# Altium schematic sheet PCIe_USB30.SchDoc
size A4; SheetNumber: 9; SheetTotal: 12
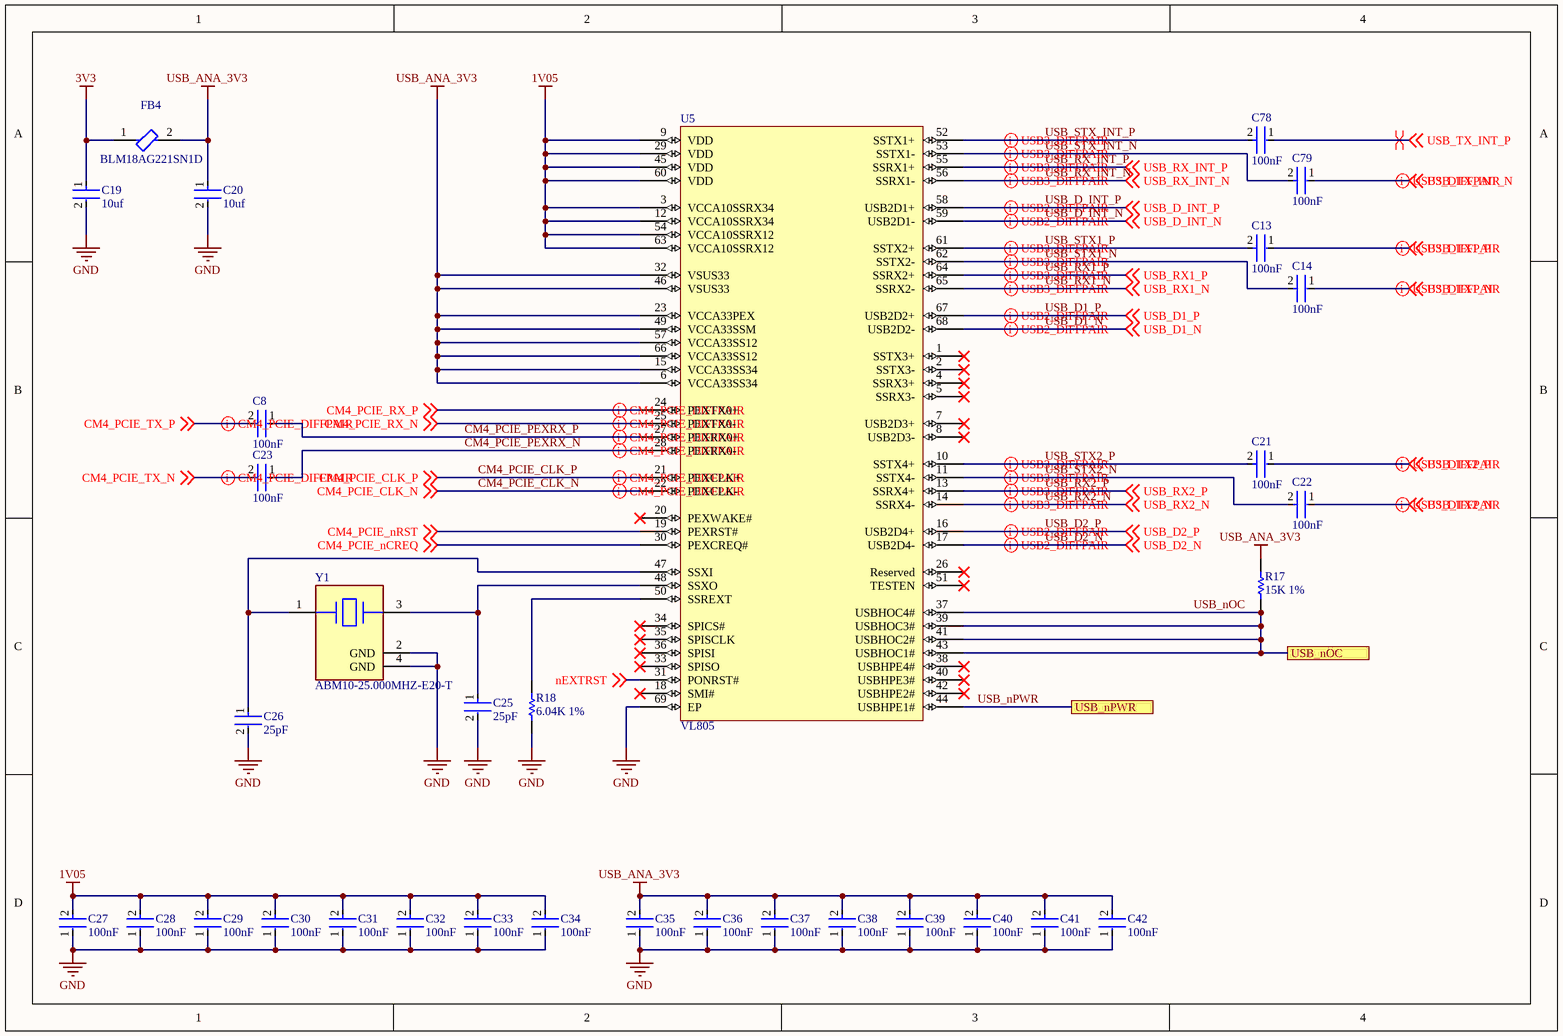
[diagram p0: PCIe_USB30.SchDoc]

## Parts
C8  100nF  [FP-GRM15-MFG]
C13  100nF  [FP-GRM15-MFG]
C14  100nF  [FP-GRM15-MFG]
C19  10uf  [FP-GRM188-0_2-IPC_C]
C20  10uf  [FP-GRM188-0_2-IPC_C]
C21  100nF  [FP-GRM15-MFG]
C22  100nF  [FP-GRM15-MFG]
C23  100nF  [FP-GRM15-MFG]
C25  25pF  [FP-C0402-BB-MFG]
C26  25pF  [FP-C0402-BB-MFG]
C27  100nF  [FP-GRM15-MFG]
C28  100nF  [FP-GRM15-MFG]
C29  100nF  [FP-GRM15-MFG]
C30  100nF  [FP-GRM15-MFG]
C31  100nF  [FP-GRM15-MFG]
C32  100nF  [FP-GRM15-MFG]
C33  100nF  [FP-GRM15-MFG]
C34  100nF  [FP-GRM15-MFG]
C35  100nF  [FP-GRM15-MFG]
C36  100nF  [FP-GRM15-MFG]
C37  100nF  [FP-GRM15-MFG]
C38  100nF  [FP-GRM15-MFG]
C39  100nF  [FP-GRM15-MFG]
C40  100nF  [FP-GRM15-MFG]
C41  100nF  [FP-GRM15-MFG]
C42  100nF  [FP-GRM15-MFG]
C78  100nF  [FP-GRM15-MFG]
C79  100nF  [FP-GRM15-MFG]
FB4  BLM18AG221SN1D  [FP-BLM18-0_15-t0_8-IPC_A]
R17  15K 1%  [RESC1005X40X25ML05T10]
R18  6.04K 1%  [RESC1005X40X25LL05T10]
U5  VL805  [VL805]
Y1  ABM10-25.000MHZ-E20-T  [FP-ABM10-MFG]

## Ports
USB_nOC, USB_nPWR

## Nets
1V05: C27.2 C28.2 C29.2 C30.2 C31.2 C32.2 C33.2 C34.2 U5.3(VCCA10SSRX34) U5.9(VDD) U5.12(VCCA10SSRX34) U5.29(VDD) U5.45(VDD) U5.54(VCCA10SSRX12) U5.60(VDD) U5.63(VCCA10SSRX12)
3V3: C19.1 FB4.1
GND: C19.2 C20.2 C25.2 C26.2 C27.1 C28.1 C29.1 C30.1 C31.1 C32.1 C33.1 C34.1 C35.1 C36.1 C37.1 C38.1 C39.1 C40.1 C41.1 C42.1 R18.1 U5.69(EP) Y1.2(GND) Y1.4(GND)
USB_ANA_3V3: C20.1 C35.2 C36.2 C37.2 C38.2 C39.2 C40.2 C41.2 C42.2 FB4.2 R17.2 U5.6(VCCA33SS34) U5.15(VCCA33SS34) U5.23(VCCA33PEX) U5.32(VSUS33) U5.46(VSUS33) U5.49(VCCA33SSM) U5.57(VCCA33SS12) U5.66(VCCA33SS12)
CM4_PCIE_CLK_N: U5.22(PEXCLK-) ; off-sheet CM4_PCIE_CLK_N
CM4_PCIE_CLK_P: U5.21(PEXCLK+) ; off-sheet CM4_PCIE_CLK_P
CM4_PCIE_nCREQ: U5.30(PEXCREQ#) ; off-sheet CM4_PCIE_nCREQ
CM4_PCIE_nRST: U5.19(PEXRST#) ; off-sheet CM4_PCIE_nRST
CM4_PCIE_PEXRX_N: C23.1 U5.28(PEXRX0-)
CM4_PCIE_PEXRX_P: C8.1 U5.27(PEXRX0+)
CM4_PCIE_RX_N: U5.25(PEXTX0-) ; off-sheet CM4_PCIE_RX_N
CM4_PCIE_RX_P: U5.24(PEXTX0+) ; off-sheet CM4_PCIE_RX_P
CM4_PCIE_TX_N: C23.2 ; off-sheet CM4_PCIE_TX_N
CM4_PCIE_TX_P: C8.2 ; off-sheet CM4_PCIE_TX_P
nEXTRST: U5.31(PONRST#) ; off-sheet nEXTRST
USB_D1_N: U5.68(USB2D2-) ; off-sheet USB_D1_N
USB_D1_P: U5.67(USB2D2+) ; off-sheet USB_D1_P
USB_D2_N: U5.17(USB2D4-) ; off-sheet USB_D2_N
USB_D2_P: U5.16(USB2D4+) ; off-sheet USB_D2_P
USB_D_INT_N: U5.59(USB2D1-) ; off-sheet USB_D_INT_N
USB_D_INT_P: U5.58(USB2D1+) ; off-sheet USB_D_INT_P
USB_nOC: R17.1 U5.37(USBHOC4#) U5.39(USBHOC3#) U5.41(USBHOC2#) U5.43(USBHOC1#) ; port USB_nOC
USB_nPWR: U5.44(USBHPE1#) ; port USB_nPWR
USB_RX1_N: U5.65(SSRX2-) ; off-sheet USB_RX1_N
USB_RX1_P: U5.64(SSRX2+) ; off-sheet USB_RX1_P
USB_RX2_N: U5.14(SSRX4-) ; off-sheet USB_RX2_N
USB_RX2_P: U5.13(SSRX4+) ; off-sheet USB_RX2_P
USB_RX_INT_N: U5.56(SSRX1-) ; off-sheet USB_RX_INT_N
USB_RX_INT_P: U5.55(SSRX1+) ; off-sheet USB_RX_INT_P
USB_STX1_N: C14.2 U5.62(SSTX2-)
USB_STX1_P: C13.2 U5.61(SSTX2+)
USB_STX2_N: C22.2 U5.11(SSTX4-)
USB_STX2_P: C21.2 U5.10(SSTX4+)
USB_STX_INT_N: C79.2 U5.53(SSTX1-)
USB_STX_INT_P: C78.2 U5.52(SSTX1+)
USB_TX1_N: C14.1 ; off-sheet USB_TX1_N
USB_TX1_P: C13.1 ; off-sheet USB_TX1_P
USB_TX2_N: C22.1 ; off-sheet USB_TX2_N
USB_TX2_P: C21.1 ; off-sheet USB_TX2_P
USB_TX_INT_N: C79.1 ; off-sheet USB_TX_INT_N
USB_TX_INT_P: C78.1 ; off-sheet USB_TX_INT_P
NetC25_1: C25.1 U5.48(SSXO) Y1.3
NetC26_1: C26.1 U5.47(SSXI) Y1.1
NetR18_2: R18.2 U5.50(SSREXT)

Not connected (* = marked no-connect by the designer): U5 1(SSTX3+)* 2(SSTX3-)* 4(SSRX3+)* 5(SSRX3-)* 7(USB2D3+)* 8(USB2D3-)* 18(SMI#)* 20(PEXWAKE#)* 26(Reserved)* 33(SPISO)* 34(SPICS#)* 35(SPISCLK)* 36(SPISI)* 38(USBHPE4#)* 40(USBHPE3#)* 42(USBHPE2#)* 51(TESTEN)*

## Layout directives
differential pair; differential pair class PCIe: CM4_PCIE_CLK_N, CM4_PCIE_CLK_P, CM4_PCIE_PEXRX_N, CM4_PCIE_PEXRX_P, CM4_PCIE_RX_N, CM4_PCIE_RX_P, CM4_PCIE_TX_N, CM4_PCIE_TX_P, USB_TX1_P
differential pair; differential pair class USB3: USB_RX1_N, USB_RX1_P, USB_RX2_N, USB_RX2_P, USB_RX_INT_N, USB_RX_INT_P, USB_STX1_N, USB_STX1_P, USB_STX2_N, USB_STX2_P, USB_STX_INT_N, USB_STX_INT_P, USB_TX1_N, USB_TX2_N, USB_TX2_P, USB_TX_INT_N
differential pair; differential pair class USB2: USB_D1_N, USB_D1_P, USB_D2_N, USB_D2_P, USB_D_INT_N, USB_D_INT_P
differential pair: USB_TX_INT_P

## Library data of the parts
C8 C13 C14 C21-C23 C27-C42 C78 C79 = CMP-2100-03641-2: CAP CER 0.1UF 16V X7R 0402; Manufacturer Part Number: GRM155R71C104KA88D; Manufacturer: Murata; Standoff Height: 0mm; Tolerance: 10%; Voltage Rating: 16Vdc; Material: Ceramic; Capacitance: 0.10μF; Value: 0.10μF; RoHS: TRUE; Temperature Characteristic: X7R; Octopart: https://octopart.com/grm155r71c104ka88d-murata-196880; Digikey Description: CAP CER 0.1UF 16V X7R 0402; Device Class L3: Ceramic Capacitors; Height: 0.55mm; ComponentLink2Description: Datasheet; Temperature Range Low: -55°C; Ipc Land Pattern Name: CAPC10050X219; ComponentLink2URL: https://search.murata.co.jp/Ceramy/image/img/A01X/G101/ENG/GRM155R71H471KA01-01A.pdf; Device Class L1: Passive Components; Lead Free: yes; Category: Cap; Package: GRM15; Temperature: -55°C to +125°C; Device Class L2: Capacitors; Temperature Range High: +125°C; Mouser Description: 0402 0.1 uF 16V ±10 % Tolerance X7R SMT Multilayer Ceramic Capacitor
C19 C20 = CMP-06035-045466-1: Chip Multilayer Ceramic Capacitors for General Purpose, 0603, 10uF, X5R, 15%, 20%, 35V; Case Code (Imperial): 0603; Voltage Rating (DC): 35V; Width: 0.031inch; Dielectric: X5R; Voltage Rating: 35V; Min Operating Temperature: -55°C; Thickness: 0.039inch; Mount: Surface Mount; Case/Package: 0603; Length: 0.063inch; Capacitance: 10uF; Max Operating Temperature: 85°C; Packaging: Tape and Reel; Tolerance: 20%; Case Code (Metric): 1608
C25 C26 = CMP-2008-03091-2: CAP CER 12PF 25V NP0 0402; Manufacturer: Kemet; Manufacturer Part Number: C0402C120J3GACTU; Temperature Coefficient: 15%; Temperature Characteristic: C0G; Material: Ceramic; Tolerance: 0.05; Mouser Description: Cap Ceramic 12pF 25V C0G 5% SMD 0402 125°C Paper T/R; Package: C0402-BB; Height: 0.55mm; Temperature: -55°C to +125°C; RoHS: TRUE; ComponentLink2Description: Datasheet; Capacitance: 12 pF; Temperature Range Low: -55°C; Automotive: No; Device Class L2: Capacitors; ComponentLink2URL: https://content.kemet.com/datasheets/KEM_C1002_X7R_SMD.pdf; Voltage Rating: 25 V; Device Class L1: Passive Components; Value: 12 pF; Digikey Description: CAP CER 12PF 25V NP0 0402; Lead Free: Yes; Category: Cap; Ipc Land Pattern Name: CAPC10050X50; Device Class L3: Ceramic Capacitors; Octopart: https://octopart.com/c0402c120j3gactu-kemet-9143703; Temperature Range High: +125°C
FB4 = CMP-0686-00445-3: Chip Ferrite Bead, 0603, 220Ω @ 100MHz, 0.25Ω, 25%, 700mA; DC Current: 500mA; DC Resistance-Max: 250mR; Shielding: Unshielded; Material: Steel; Impedance: 220R; Number of Lines: 1; Max Operating Temperature: 125°C; Military Standard: Not; Min Operating Temperature: -55°C; Max DC Current: 500mA; Case/Package: 0603; Termination: SMD/SMT; Current Rating: 500mA; REACH SVHC: No SVHC; Depth: 0.8mm; Number of Pins: 2; Radiation Hardening: No; Length: 1.6mm; Packaging: Tape and Reel; Test Frequency: 100MHz; Series: BLM18A; Package Quantity: 1; Tolerance: 25%; Case Code (Imperial): 0603; DC Resistance (DCR): 250mR; Height: 0.8mm; Lead Free: Lead Free; Width: 0.8mm; Case Code (Metric): 1608; RoHS Compliant: Yes; Frequency: 100MHz; Core Material: Ferrite; Number of Circuits: 1; Max Current Rating: 500mA
R17 = CMP-2002-07410-1: Manufacturer: Yageo / Phycomp; Part Number: RC0402FR0715KL
R18 = CMP-2002-07778-1: Part Number: RC0402FR-076K04L; Manufacturer: Yageo
Y1 = CMP-27762-004420-1: Crystal 25MHz ±20ppm 10pF SMD-4 2.5mm x 2mm; ESR (Equivalent Series Resistance): 100R; Frequency Stability: 20ppm; Termination: SMD/SMT; Height: 0.02inch; Depth: 2mm; Lead Free: Lead Free; Case/Package: CSMD; Operating Frequency: 25 MHz; Frequency Tolerance: 20ppm; Tolerance: 20ppm; Width: 2mm; Frequency: 25MHz; Packaging: Tape and Reel; Min Operating Temperature: -20°C; Max Operating Temperature: 70°C; Length: 2.5mm; Series: ABM10; REACH SVHC: No SVHC; Mount: Surface Mount; Package Quantity: 1000; Load Capacitance: 10pF; Number of Pins: 4; Series Resistance: 100R